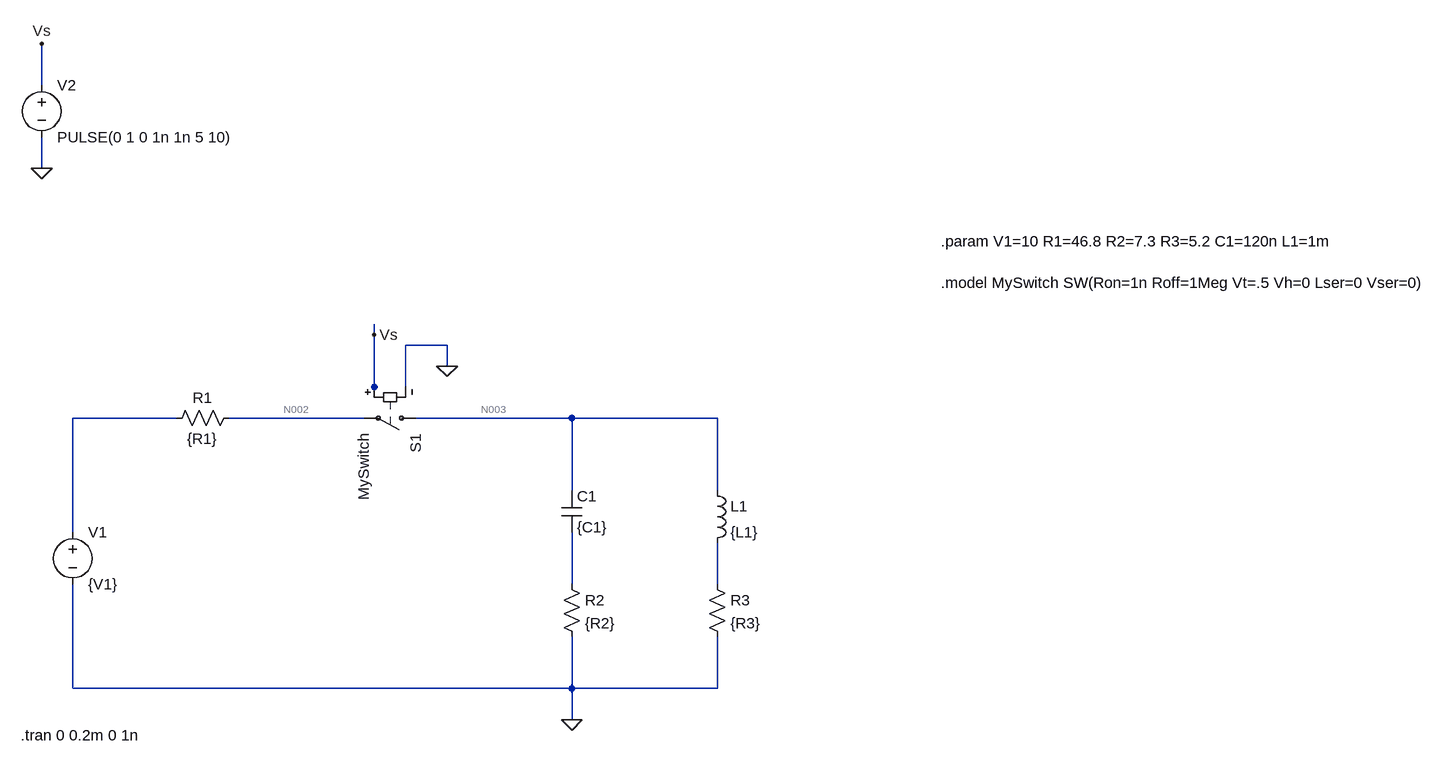
[diagram p0: schematic InterruptorSeCierra.asc]
InterruptorSeCierra.asc, the LTspice schematic file:
Version 4.1
SHEET 1 1656 680
WIRE -544 -608 -544 -672
WIRE -544 -480 -544 -528
WIRE -32 -224 -32 -240
WIRE 80 -208 16 -208
WIRE 80 -176 80 -208
WIRE -32 -144 -32 -224
WIRE 16 -144 16 -208
WIRE -32 -128 -32 -144
WIRE -336 -96 -496 -96
WIRE -48 -96 -256 -96
WIRE 272 -96 32 -96
WIRE 496 -96 272 -96
WIRE 272 16 272 -96
WIRE 496 16 496 -96
WIRE -496 80 -496 -96
WIRE 272 160 272 80
WIRE 496 160 496 96
WIRE -496 320 -496 160
WIRE 272 320 272 240
WIRE 272 320 -496 320
WIRE 496 320 496 240
WIRE 496 320 272 320
WIRE 272 368 272 320
FLAG 272 368 0
FLAG -32 -224 Vs
FLAG -544 -480 0
FLAG -544 -672 Vs
FLAG 80 -176 0
SYMBOL voltage -496 64 R0
SYMATTR InstName V1
SYMATTR Value {V1}
SYMBOL res -240 -112 R90
WINDOW 0 0 56 VBottom 2
WINDOW 3 32 56 VTop 2
SYMATTR InstName R1
SYMATTR Value {R1}
SYMBOL sw 48 -96 R90
SYMATTR InstName S1
SYMATTR Value MySwitch
SYMBOL cap 256 16 R0
SYMATTR InstName C1
SYMATTR Value {C1}
SYMBOL res 256 144 R0
SYMATTR InstName R2
SYMATTR Value {R2}
SYMBOL ind 480 0 R0
SYMATTR InstName L1
SYMATTR Value {L1}
SYMBOL res 480 144 R0
SYMATTR InstName R3
SYMATTR Value {R3}
SYMBOL voltage -544 -624 R0
WINDOW 123 0 0 Left 0
WINDOW 39 0 0 Left 0
SYMATTR InstName V2
SYMATTR Value PULSE(0 1 0 1n 1n 5 10)
TEXT 840 -368 Left 2 !.param V1=10 R1=46.8 R2=7.3 R3=5.2 C1=120n L1=1m
TEXT 840 -304 Left 2 !.model MySwitch SW(Ron=1n Roff=1Meg Vt=.5 Vh=0 Lser=0 Vser=0)
TEXT -576 392 Left 2 !.tran 0 0.2m 0 1n

The netlist it stands for:
* InterruptorSeCierra.asc
V1 N001 0 {V1}
R1 N002 N001 {R1}
S1 N003 N002 Vs 0 MySwitch
C1 N003 N004 {C1}
R2 N004 0 {R2}
L1 N003 N005 {L1}
R3 N005 0 {R3}
V2 Vs 0 PULSE(0 1 0 1n 1n 5 10)
.param V1=10 R1=46.8 R2=7.3 R3=5.2 C1=120n L1=1m
.model MySwitch SW(Ron=1n Roff=1Meg Vt=.5 Vh=0 Lser=0 Vser=0)
.tran 0 0.2m 0 1n
.backanno
.end

* Results of the author's LTspice run, read from the files saved beside the schematic
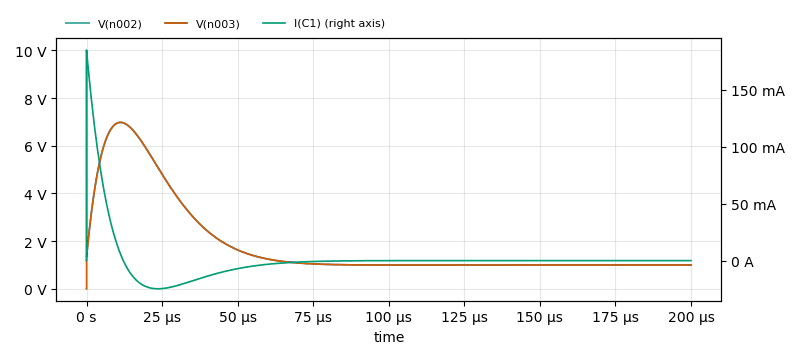
[diagram p1: Transient Analysis of InterruptorSeCierra.asc, plotted from the saved traces]
* Transient Analysis, 1 run:
*   V(n002): min 997.3 mV, max 10 V, average 1.863 V, rms 2.515 V, last 1 V
*   V(n003): min 52.01 µV, max 6.98 V, average 1.863 V, rms 2.515 V, last 1 V
*   I(C1): min -24.78 mA, max 184.8 mA, average 603.5 µA, rms 22.77 mA, last -30.74 nA